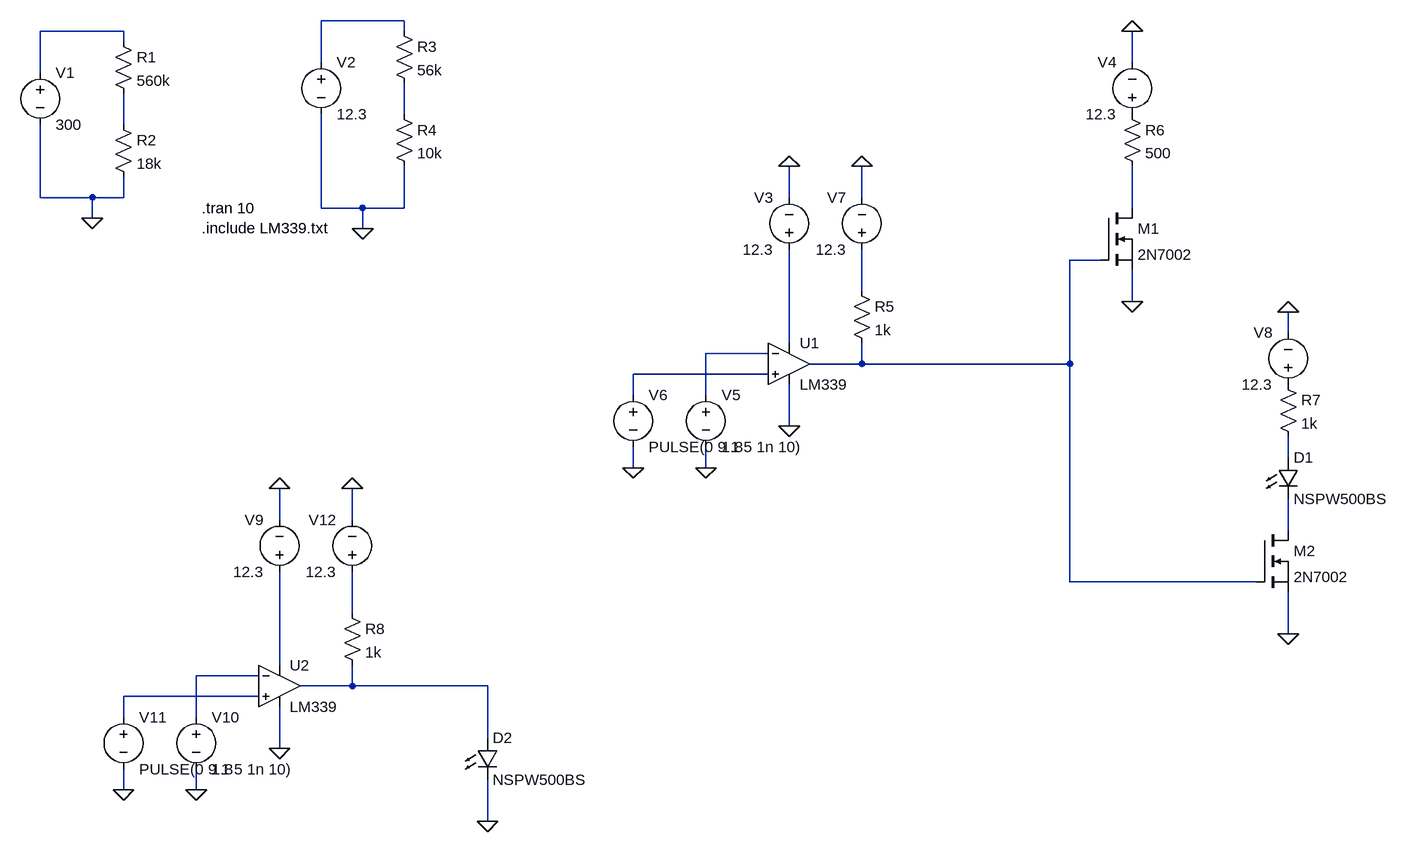
[diagram p0: schematic Buck converter_Voltage measurement.asc]
Buck converter_Voltage measurement.asc, the LTspice schematic file:
Version 4
SHEET 1 1792 1312
WIRE 288 64 160 64
WIRE -144 80 -272 80
WIRE 288 80 288 64
WIRE -144 96 -144 80
WIRE 160 128 160 64
WIRE 1408 128 1408 80
WIRE -272 144 -272 80
WIRE 288 208 288 160
WIRE -144 224 -144 176
WIRE -272 336 -272 224
WIRE -192 336 -272 336
WIRE -144 336 -144 304
WIRE -144 336 -192 336
WIRE 880 336 880 288
WIRE 992 336 992 288
WIRE 160 352 160 208
WIRE 224 352 160 352
WIRE 288 352 288 288
WIRE 288 352 224 352
WIRE 1408 352 1408 288
WIRE -192 368 -192 336
WIRE 224 384 224 352
WIRE 1360 432 1312 432
WIRE 992 480 992 416
WIRE 1408 496 1408 448
WIRE 1648 544 1648 512
WIRE 880 560 880 416
WIRE 848 576 752 576
WIRE 992 592 992 560
WIRE 992 592 912 592
WIRE 1312 592 1312 432
WIRE 1312 592 992 592
WIRE 848 608 640 608
WIRE 640 640 640 608
WIRE 752 640 752 576
WIRE 880 688 880 624
WIRE 1648 736 1648 704
WIRE 640 752 640 720
WIRE 752 752 752 720
WIRE 96 832 96 784
WIRE 208 832 208 784
WIRE 1648 848 1648 800
WIRE 1312 928 1312 592
WIRE 1600 928 1312 928
WIRE 208 976 208 912
WIRE 1648 1008 1648 944
WIRE 96 1056 96 912
WIRE 64 1072 -32 1072
WIRE 208 1088 208 1056
WIRE 208 1088 128 1088
WIRE 416 1088 208 1088
WIRE 64 1104 -144 1104
WIRE -144 1136 -144 1104
WIRE -32 1136 -32 1072
WIRE 416 1168 416 1088
WIRE 96 1184 96 1120
WIRE -144 1248 -144 1216
WIRE -32 1248 -32 1216
WIRE 416 1296 416 1232
FLAG -192 368 0
FLAG 224 384 0
FLAG 880 688 0
FLAG 880 288 0
FLAG 1408 496 0
FLAG 1408 80 0
FLAG 752 752 0
FLAG 640 752 0
FLAG 992 288 0
FLAG 1648 512 0
FLAG 1648 1008 0
FLAG 96 1184 0
FLAG 96 784 0
FLAG -32 1248 0
FLAG -144 1248 0
FLAG 208 784 0
FLAG 416 1296 0
SYMBOL voltage -272 128 R0
SYMATTR InstName V1
SYMATTR Value 300
SYMBOL Res -160 80 R0
SYMATTR InstName R1
SYMATTR Value 560k
SYMBOL Res -160 208 R0
SYMATTR InstName R2
SYMATTR Value 18k
SYMBOL voltage 160 112 R0
SYMATTR InstName V2
SYMATTR Value 12.3
SYMBOL Res 272 64 R0
SYMATTR InstName R3
SYMATTR Value 56k
SYMBOL Res 272 192 R0
SYMATTR InstName R4
SYMATTR Value 10k
SYMBOL OpAmps/opamp2 880 528 R0
SYMATTR InstName U1
SYMATTR Value LM339
SYMBOL Voltage 880 432 R180
WINDOW 0 24 96 Left 2
WINDOW 3 24 16 Left 2
SYMATTR InstName V3
SYMATTR Value 12.3
SYMBOL Res 976 464 R0
SYMATTR InstName R5
SYMATTR Value 1k
SYMBOL nmos 1360 352 R0
SYMATTR InstName M1
SYMATTR Value 2N7002
SYMBOL Res 1392 192 R0
SYMATTR InstName R6
SYMATTR Value 500
SYMBOL Voltage 1408 224 R180
WINDOW 0 24 96 Left 2
WINDOW 3 24 16 Left 2
SYMATTR InstName V4
SYMATTR Value 12.3
SYMBOL Voltage 752 624 R0
SYMATTR InstName V5
SYMATTR Value 1.8
SYMBOL Voltage 640 624 R0
SYMATTR InstName V6
SYMATTR Value PULSE(0 9 1 5 1n 10)
SYMBOL Voltage 992 432 R180
WINDOW 0 24 96 Left 2
WINDOW 3 24 16 Left 2
SYMATTR InstName V7
SYMATTR Value 12.3
SYMBOL LED 1632 736 R0
SYMATTR InstName D1
SYMATTR Value NSPW500BS
SYMATTR Description Diode
SYMATTR Type diode
SYMBOL Res 1632 608 R0
SYMATTR InstName R7
SYMATTR Value 1k
SYMBOL nmos 1600 848 R0
SYMATTR InstName M2
SYMATTR Value 2N7002
SYMBOL Voltage 1648 640 R180
WINDOW 0 24 96 Left 2
WINDOW 3 24 16 Left 2
SYMATTR InstName V8
SYMATTR Value 12.3
SYMBOL OpAmps/opamp2 96 1024 R0
SYMATTR InstName U2
SYMATTR Value LM339
SYMBOL Voltage 96 928 R180
WINDOW 0 24 96 Left 2
WINDOW 3 24 16 Left 2
SYMATTR InstName V9
SYMATTR Value 12.3
SYMBOL Res 192 960 R0
SYMATTR InstName R8
SYMATTR Value 1k
SYMBOL Voltage -32 1120 R0
SYMATTR InstName V10
SYMATTR Value 1.8
SYMBOL Voltage -144 1120 R0
SYMATTR InstName V11
SYMATTR Value PULSE(0 9 1 5 1n 10)
SYMBOL Voltage 208 928 R180
WINDOW 0 24 96 Left 2
WINDOW 3 24 16 Left 2
SYMATTR InstName V12
SYMATTR Value 12.3
SYMBOL LED 400 1168 R0
SYMATTR InstName D2
SYMATTR Value NSPW500BS
SYMATTR Description Diode
SYMATTR Type diode
TEXT -24 352 Left 2 !.tran 10\n.include LM339.txt

The netlist it stands for:
* Buck converter_Voltage measurement.asc
V1 N002 0 300
R1 N002 N004 560k
R2 N004 0 18k
V2 N001 0 12.3
R3 N001 N003 56k
R4 N003 0 10k
XU1 N010 N009 N008 0 N006 LM339  ; pins In+ In- V+ V- OUT
V3 N008 0 12.3
R5 N007 N006 1k
M1 N005 N006 0 0 2N7002
R6 P001 N005 500
V4 P001 0 12.3
V5 N009 0 1.8
V6 N010 0 PULSE(0 9 1 5 1n 10)
V7 N007 0 12.3
D1 N011 N012 NSPW500BS
R7 P002 N011 1k
M2 N012 N006 0 0 2N7002
V8 P002 0 12.3
XU2 N017 N015 N014 0 N016 LM339  ; pins In+ In- V+ V- OUT
V9 N014 0 12.3
R8 N013 N016 1k
V10 N015 0 1.8
V11 N017 0 PULSE(0 9 1 5 1n 10)
V12 N013 0 12.3
D2 N016 0 NSPW500BS
.model D D
.lib standard.dio
.model NMOS NMOS
.model PMOS PMOS
.lib standard.mos
.tran 10
.include LM339.txt
.backanno
.end